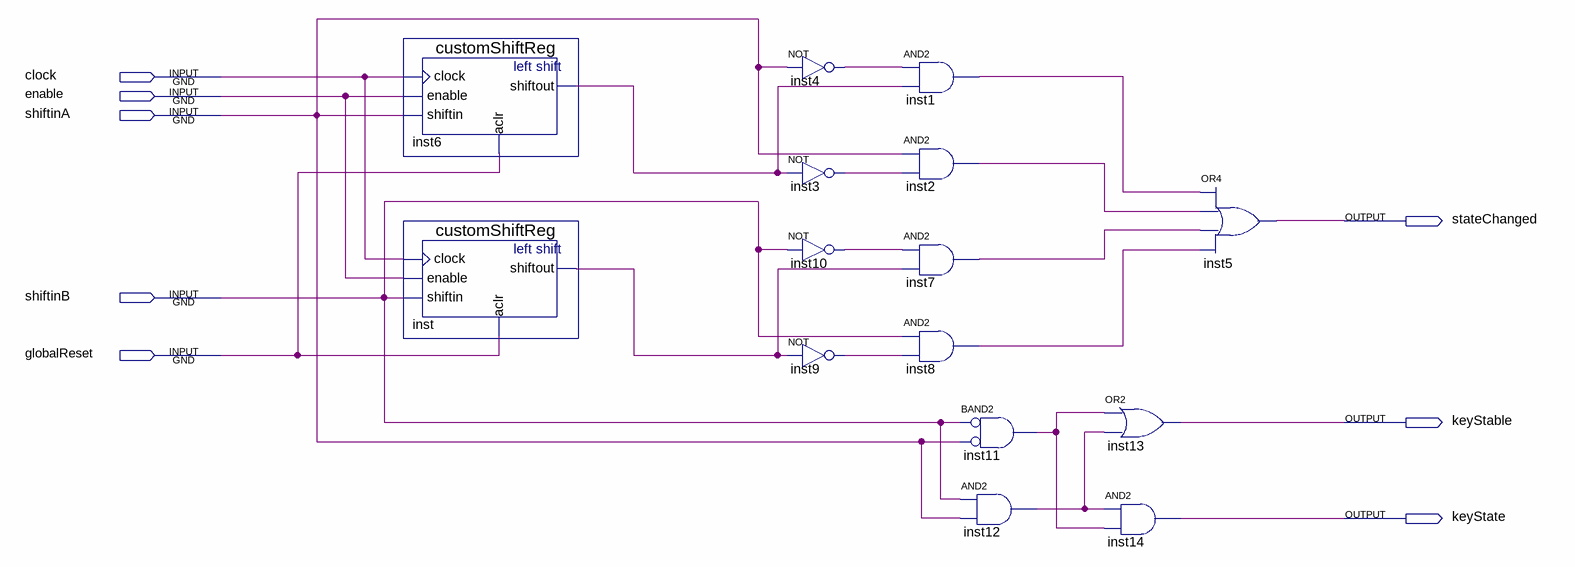
[diagram p0: schematic sheet]
// Quartus schematic InputStage.bdf as structural Verilog: 15 symbols, 8 pins
module InputStage (
  input  clock,
  input  enable,
  input  shiftinA,
  input  shiftinB,
  input  globalReset,
  output stateChanged,
  output keyStable,
  output keyState
);

  wire inst1_out, inst2_out, inst3_out, inst4_out, inst6_shiftout, inst7_out, inst8_out, inst9_out,
       inst10_out, inst11_out, inst12_out, inst_shiftout;

  customShiftReg inst6 (
    .clock(clock), .enable(enable), .shiftin(shiftinA), .aclr(globalReset), .shiftout(inst6_shiftout));
  customShiftReg inst (
    .clock(clock), .enable(enable), .shiftin(shiftinB), .aclr(globalReset), .shiftout(inst_shiftout));
  not inst4 (inst4_out, shiftinA);
  not inst3 (inst3_out, inst6_shiftout);
  not inst10 (inst10_out, shiftinB);
  not inst9 (inst9_out, inst_shiftout);
  and inst1 (inst1_out, inst4_out, inst6_shiftout);
  and inst2 (inst2_out, shiftinA, inst3_out);
  and inst7 (inst7_out, inst10_out, inst_shiftout);
  and inst8 (inst8_out, shiftinB, inst9_out);
  and inst11 (inst11_out, ~shiftinB, ~shiftinA);  // BAND2
  and inst12 (inst12_out, shiftinB, shiftinA);
  or inst13 (keyStable, inst11_out, inst12_out);
  and inst14 (keyState, inst12_out, inst11_out);
  or inst5 (stateChanged, inst1_out, inst2_out, inst7_out, inst8_out);
endmodule
